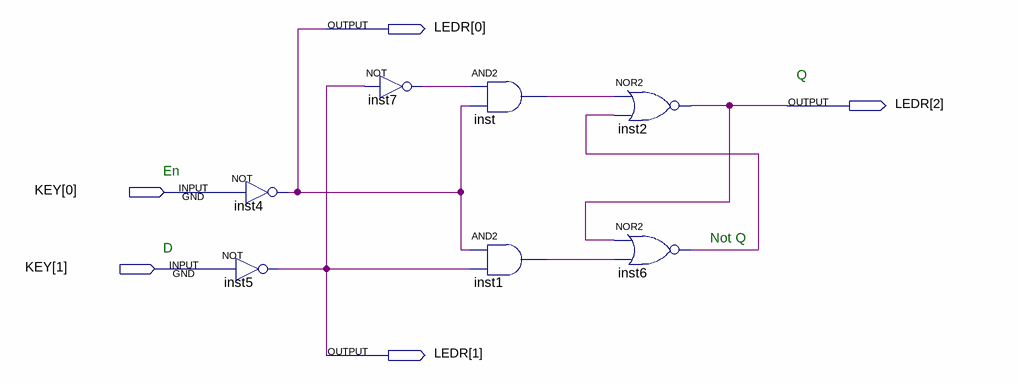
[diagram p0: schematic sheet]
// Quartus schematic basics.bdf as structural Verilog: 7 symbols, 5 pins
module basics (
  input  [1:0] KEY,
  output [2:0] LEDR
);

  wire inst1_out, inst6_out, inst7_out, inst_out;

  not inst4 (LEDR[0], KEY[0]);
  not inst5 (LEDR[1], KEY[1]);
  not inst7 (inst7_out, LEDR[1]);
  and inst (inst_out, inst7_out, LEDR[0]);
  and inst1 (inst1_out, LEDR[0], LEDR[1]);
  nor inst2 (LEDR[2], inst_out, inst6_out);
  nor inst6 (inst6_out, LEDR[2], inst1_out);

  // Notes on the sheet:
  //   Q
  //   En
  //   Not Q
  //   D
endmodule
